# Altium project 80352201 - Main.PrjPcb
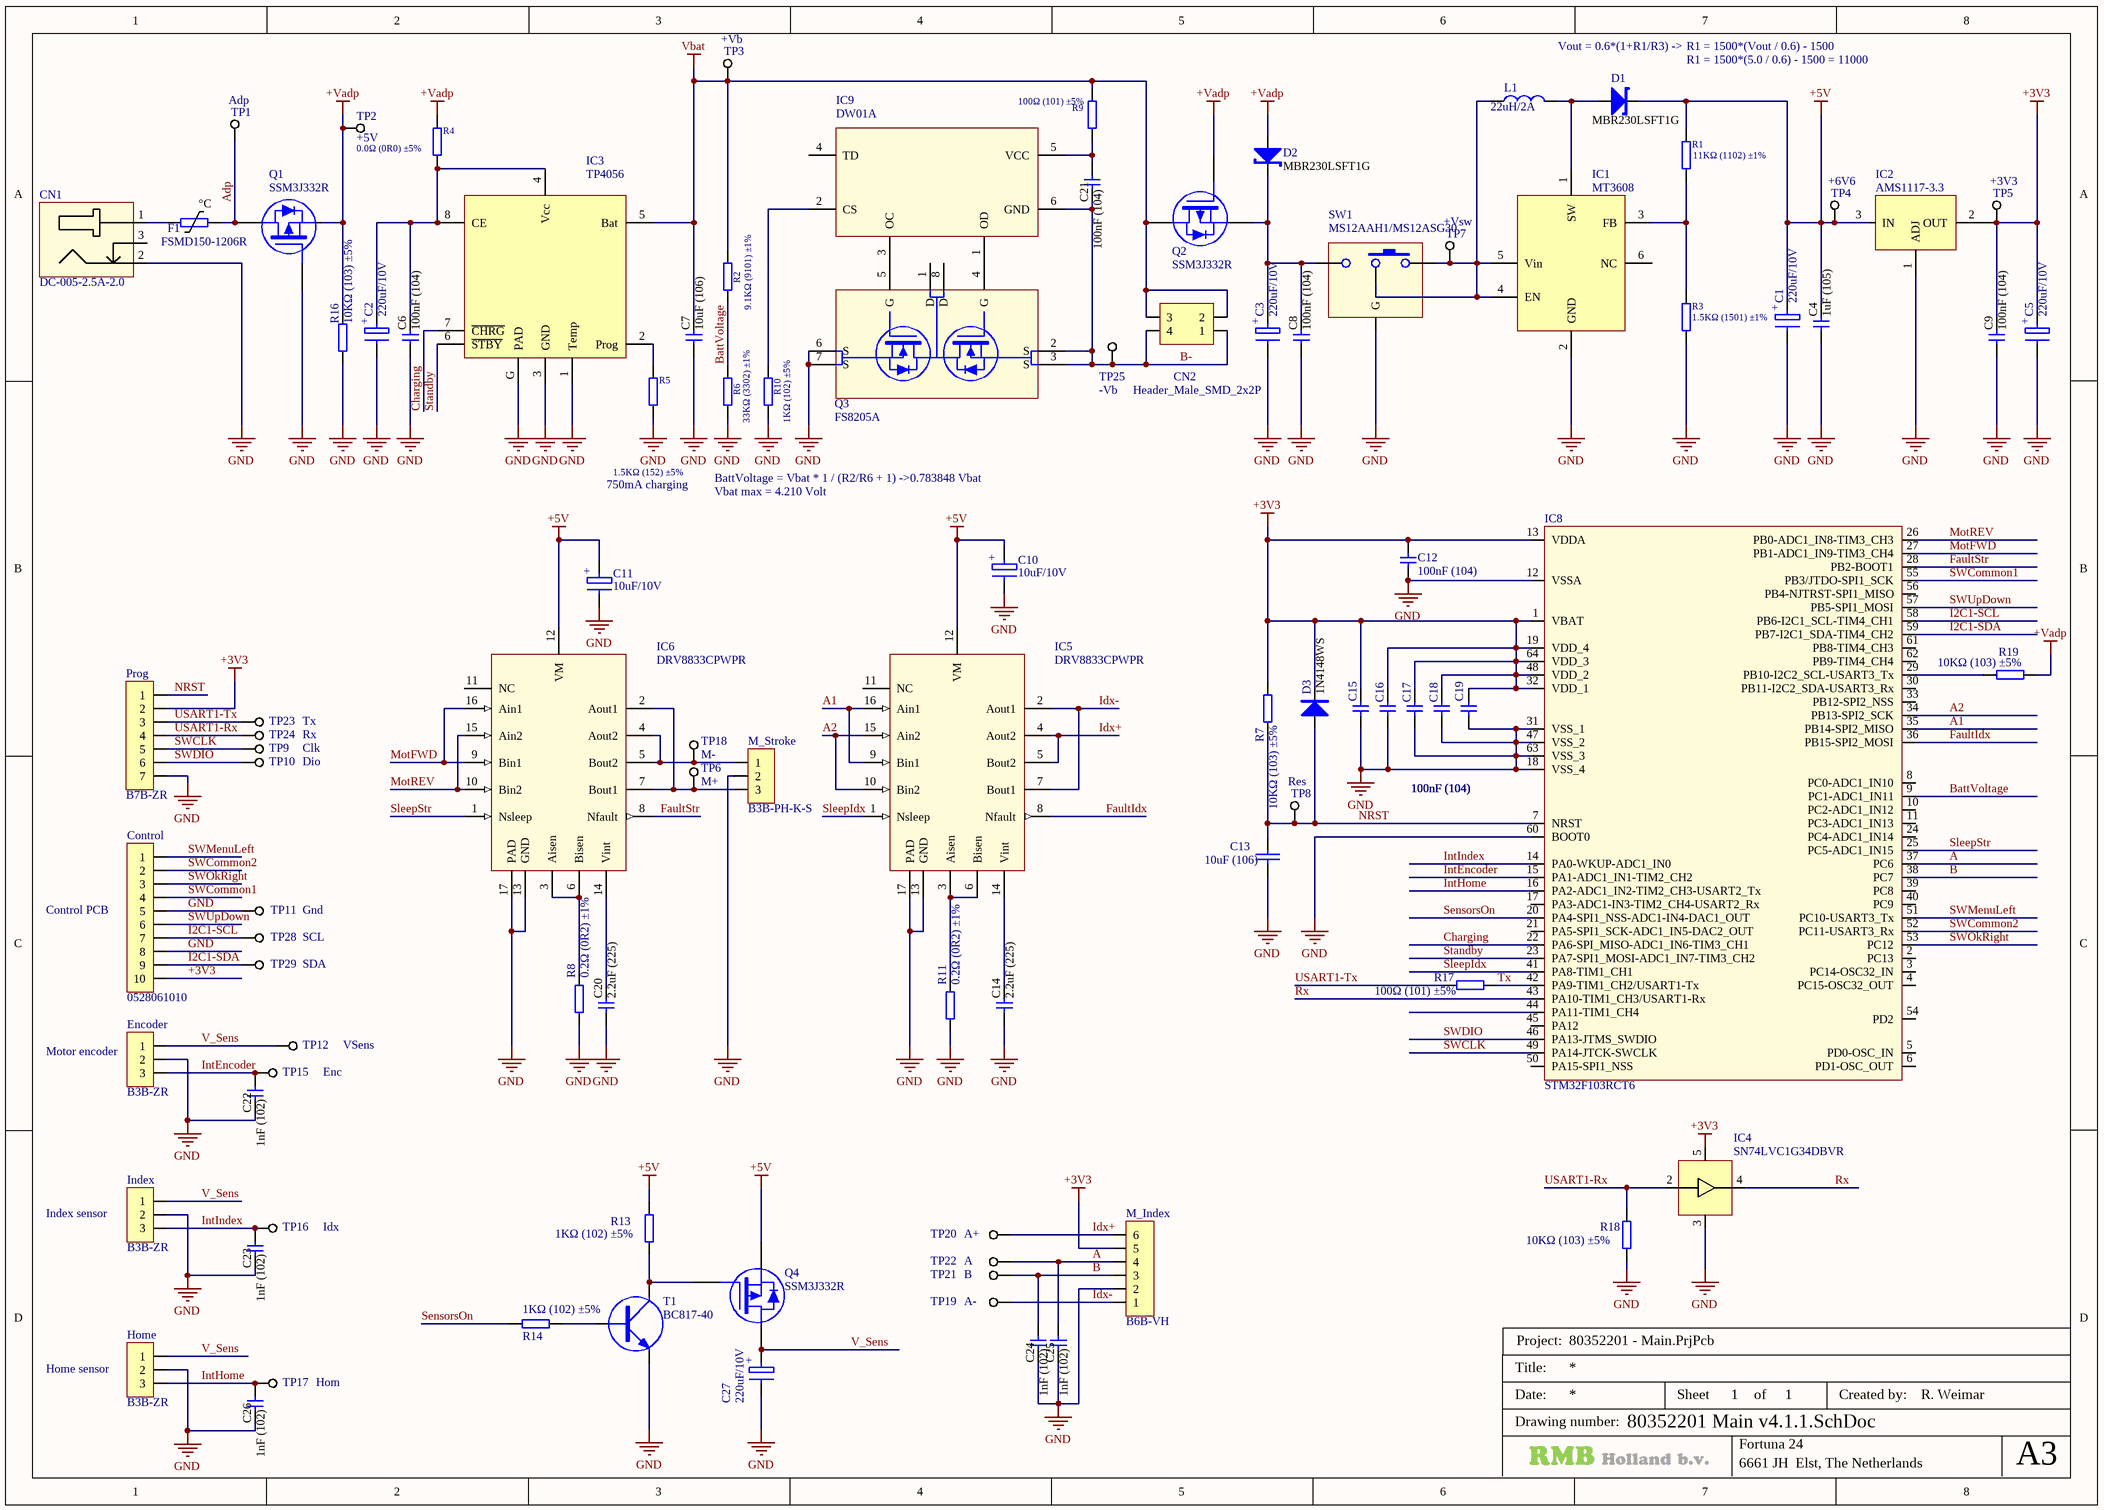
[diagram p0: 80352201 Main v4.1.1.SchDoc]
1 sheet, 97 parts. Net scope: global (net labels, ports and power ports of the same name join across sheets).
Board file: 80362201 Main v4.1.1.PcbDoc

## Sheet 80352201 Main v4.1.1.SchDoc
size A3; SheetNumber: 1; SheetTotal: 1

### Parts
C1  220uF/10V  [C/CAP_POL_6032-28]
C2  220uF/10V  [C/CAP_POL_6032-28]
C3  220uF/10V  [C/CAP_POL_6032-28]
C4  1uF (105)  [C/0603/H]
C5  220uF/10V  [C/CAP_POL_6032-28]
C6  100nF (104)  [C/0603/H]
C7  10uF (106)  [C/0603/H]
C8  100nF (104)  [C/0603/H]
C9  100nF (104)  [C/0603/H]
C10  10uF/10V  [C/CAP_POL_3216-18]
C11  10uF/10V  [C/CAP_POL_3216-18]
C12  100nF (104)  [C/0603/H]
C13  10uF (106)  [C/0603/H]
C14  2.2uF (225)  [C/0603/H]
C15  100nF (104)  [C/0603/H]
C16  100nF (104)  [C/0603/H]
C17  100nF (104)  [C/0603/H]
C18  100nF (104)  [C/0603/H]
C19  100nF (104)  [C/0603/H]
C20  2.2uF (225)  [C/0603/H]
C21  100nF (104)  [C/0603/H]
C22  1nF (102)  [C/0603/H]
C23  1nF (102)  [C/0603/H]
C24  1nF (102)  [C/0603/H]
C25  1nF (102)  [C/0603/H]
C26  1nF (102)  [C/0603/H]
C27  220uF/10V  [C/CAP_POL_6032-28]
CN1  DC-005-2.5A-2.0  [DC-005-2.5A-2.5]
CN2  Header_Male_SMD_2x2P  [Header2x2P_L10]
Control  0528061010  [FPC_1.0-10P_Straight]
D1  MBR230LSFT1G  [SOD123LF]
D2  MBR230LSFT1G  [SOD123LF]
D3  1N4148WS  [SOD123]
Encoder  B3B-ZR  [B3B-ZR]
F1  FSMD150-1206R  [F/1206R_PTC]
Home  B3B-ZR  [B3B-ZR]
IC1  MT3608  [IC/SOT23-6L]
IC2  AMS1117-3.3  [SOT223/Rest]
IC3  TP4056  [HSOP-8]
IC4  SN74LVC1G34DBVR  [SOT753]
IC5  DRV8833CPWPR  [HTSSOP16]
IC6  DRV8833CPWPR  [HTSSOP16]
IC8  STM32F103RCT6  [LQFP64]
IC9  DW01A  [IC/SOT23-6L]
Index  B3B-ZR  [B3B-ZR]
L1  22uH/2A  [Coil12x12]
M_Index  B6B-VH  [B6B-ZR]
M_Stroke  B3B-PH-K-S  [B3B-PH-KL]
Prog  B7B-ZR  [B7B-ZR]
Q1  SSM3J332R  [SOT23-F]
Q2  SSM3J332R  [SOT23-F]
Q3  FS8205A  [TSSOP-8]
Q4  SSM3J332R  [SOT23-F]
R1  11KΩ (1102) ±1%  [r/0603/H]
R2  9.1KΩ (9101) ±1%  [r/0603/H]
R3  1.5KΩ (1501) ±1%  [r/0603/H]
R4  0.0Ω (0R0) ±5%  [R/1206/b]
R5  1.5KΩ (152) ±5%  [r/0603/H]
R6  33KΩ (3302) ±1%  [r/0603/H]
R7  10KΩ (103) ±5%  [r/0603/H]
R8  0.2Ω (0R2) ±1%  [R/2512]
R9  100Ω (101) ±5%  [r/0603/H]
R10  1KΩ (102) ±5%  [r/0603/H]
R11  0.2Ω (0R2) ±1%  [R/2512]
R13  1KΩ (102) ±5%  [r/0603/H]
R14  1KΩ (102) ±5%  [r/0603/H]
R16  10KΩ (103) ±5%  [r/0603/H]
R17  100Ω (101) ±5%  [r/0603/H]
R18  10KΩ (103) ±5%  [r/0603/H]
R19  10KΩ (103) ±5%  [r/0603/H]
SW1  MS12AAH1/MS12ASG30  [NKK_MS12AAH1]
T1  BC817-40  [T/NPN/TO23]
TP1  Adp  [TestPoint1.2]
TP2  +5V  [TestPoint1.2]
TP3  +Vb  [TestPoint1.2]
TP4  +6V6  [TestPoint1.2]
TP5  +3V3  [TestPoint1.2]
TP6  M+  [TestPoint1.2]
TP7  +Vsw  [TestPoint1.2]
TP8  Res  [TestPoint1.2]
TP9  Clk  [TestPoint1.2]
TP10  Dio  [TestPoint1.2]
TP11  Gnd  [TestPoint1.2]
TP12  VSens  [TestPoint1.2]
TP15  Enc  [TestPoint1.2]
TP16  Idx  [TestPoint1.2]
TP17  Hom  [TestPoint1.2]
TP18  M-  [TestPoint1.2]
TP19  A-  [TestPoint1.2]
TP20  A+  [TestPoint1.2]
TP21  B  [TestPoint1.2]
TP22  A  [TestPoint1.2]
TP23  Tx  [TestPoint1.2]
TP24  Rx  [TestPoint1.2]
TP25  -Vb  [TestPoint1.2]
TP28  SCL  [TestPoint1.2]
TP29  SDA  [TestPoint1.2]

### Nets
+3V3: C5.2 C9.1 C12.1 C15.1 C16.2 C17.2 C18.2 C19.1 Control.10 D3.K IC2.2(OUT) IC4.5(VCC) IC8.1(VBAT) IC8.13(VDDA) IC8.19(VDD_4) IC8.32(VDD_1) IC8.48(VDD_2) IC8.64(VDD_3) M_Index.5 Prog.2 R7.2 TP5.1
+5V: C1.2 C4.1 C10.2 C11.2 D1.K IC2.3(IN) IC5.12(VM) IC6.12(VM) Q4.S R1.2 R13.2 TP4.1
+Vadp: D2.A Q1.S Q2.G R4.2 R16.2 R19.1 TP2.1
GND: C1.1 C2.1 C3.1 C4.2 C5.1 C6.2 C7.2 C8.2 C9.2 C10.1 C11.1 C12.2 C13.2 C14.2 C15.2 C16.1 C17.1 C18.1 C19.2 C20.2 C22.2 C23.2 C24.2 C25.2 C26.2 C27.1 CN1.2 Control.5 Control.8 Encoder.2 Home.2 IC1.2(GND) IC2.1(ADJ) IC3.1(Temp) IC3.3(GND) IC3.G(PAD) IC4.3(GND) IC5.13(GND) IC5.17(PAD) IC6.13(GND) IC6.17(PAD) IC8.12(VSSA) IC8.18(VSS_4) IC8.31(VSS_1) IC8.47(VSS_2) IC8.60(BOOT0) IC8.63(VSS_3) Index.2 M_Index.2 M_Stroke.2 Prog.7 Q1.G Q3.6(S) Q3.7(S) R3.1 R5.1 R6.1 R8.1 R10.1 R11.1 R16.1 R18.2 SW1.G T1.E TP11.1
Vbat: C7.1 CN2.2 CN2.3 IC3.5(Bat) Q2.D R2.2 R9.1 TP3.1
A: C25.1 IC8.37(PC6) M_Index.4 TP22.1
A1: IC5.9(Bin1) IC5.16(Ain1) IC8.35(PB14-SPI2_MISO)
A2: IC5.10(Bin2) IC5.15(Ain2) IC8.34(PB13-SPI2_SCK)
Adp: F1.2 Q1.D TP1.1
B: C24.1 IC8.38(PC7) M_Index.3 TP21.1
B-: C21.2 CN2.1 CN2.4 IC9.6(GND) Q3.2(S) Q3.3(S) TP25.1
BattVoltage: IC8.9(PC1-ADC1_IN11) R2.1 R6.2
Charging: IC3.7(~{CHRG}) IC8.22(PA6-SPI_MISO-ADC1_IN6-TIM3_CH1)
FaultIdx: IC5.8(Nfault) IC8.36(PB15-SPI2_MOSI)
FaultStr: IC6.8(Nfault) IC8.28(PB2-BOOT1)
I2C1-SCL: Control.7 IC8.58(PB6-I2C1_SCL-TIM4_CH1) TP28.1
I2C1-SDA: Control.9 IC8.59(PB7-I2C1_SDA-TIM4_CH2) TP29.1
Idx+: IC5.4(Aout2) IC5.5(Bout2) M_Index.6 TP20.1
Idx-: IC5.2(Aout1) IC5.7(Bout1) M_Index.1 TP19.1
IntEncoder: C22.1 Encoder.3 IC8.15(PA1-ADC1_IN1-TIM2_CH2) TP15.1
IntHome: C26.1 Home.3 IC8.16(PA2-ADC1_IN2-TIM2_CH3-USART2_Tx) TP17.1
IntIndex: C23.1 IC8.14(PA0-WKUP-ADC1_IN0) Index.3 TP16.1
MotFWD: IC6.9(Bin1) IC6.16(Ain1) IC8.27(PB1-ADC1_IN9-TIM3_CH4)
MotREV: IC6.10(Bin2) IC6.15(Ain2) IC8.26(PB0-ADC1_IN8-TIM3_CH3)
NRST: C13.1 D3.A IC8.7(NRST) Prog.1 R7.1 TP8.1
Rx: IC4.4(Y) IC8.43(PA10-TIM1_CH3/USART1-Rx)
SensorsOn: IC8.20(PA4-SPI1_NSS-ADC1-IN4-DAC1_OUT) R14.1
SleepIdx: IC5.1(Nsleep) IC8.41(PA8-TIM1_CH1)
SleepStr: IC6.1(Nsleep) IC8.25(PC5-ADC1_IN15)
Standby: IC3.6(~{STBY}) IC8.23(PA7-SPI1_MOSI-ADC1_IN7-TIM3_CH2)
SWCLK: IC8.49(PA14-JTCK-SWCLK) Prog.5 TP9.1
SWCommon1: Control.4 IC8.55(PB3/JTDO-SPI1_SCK)
SWCommon2: Control.2 IC8.52(PC11-USART3_Rx)
SWDIO: IC8.46(PA13-JTMS_SWDIO) Prog.6 TP10.1
SWMenuLeft: Control.1 IC8.51(PC10-USART3_Tx)
SWOkRight: Control.3 IC8.53(PC12)
SWUpDown: Control.6 IC8.57(PB5-SPI1_MOSI)
Tx: IC8.42(PA9-TIM1_CH2/USART1-Tx) R17.1
USART1-Rx: IC4.2(A) Prog.4 R18.1 TP24.1
USART1-Tx: Prog.3 R17.2 TP23.1
V_Sens: C27.2 Encoder.1 Home.1 Index.1 Q4.D TP12.1
NetC2_2: C2.2 C6.1 IC3.4(Vcc) IC3.8(CE) R4.1
NetC3_2: C3.2 C8.1 D2.K Q2.S SW1.3
NetC14_1: C14.1 IC5.14(Vint)
NetC20_1: C20.1 IC6.14(Vint)
NetC21_1: C21.1 IC9.5(VCC) R9.2
NetCN1_1: CN1.1 F1.1
NetD1_A: D1.A IC1.1(SW) L1.2
NetIC1_3: IC1.3(FB) R1.1 R3.2
NetIC1_4: IC1.4(EN) IC1.5(Vin) L1.1 SW1.1 SW1.2 TP7.1
NetIC3_2: IC3.2(Prog) R5.2
NetIC5_3: IC5.3(Aisen) IC5.6(Bisen) R11.2
NetIC6_2: IC6.2(Aout1) IC6.7(Bout1) M_Stroke.3 TP6.1
NetIC6_3: IC6.3(Aisen) IC6.6(Bisen) R8.2
NetIC6_4: IC6.4(Aout2) IC6.5(Bout2) M_Stroke.1 TP18.1
NetIC8_29: IC8.29(PB10-I2C2_SCL-USART3_Tx) R19.2
NetIC9_1: IC9.1(OD) Q3.4(G)
NetIC9_2: IC9.2(CS) R10.2
NetIC9_3: IC9.3(OC) Q3.5(G)
NetQ4_G: Q4.G R13.1 T1.C
NetR14_2: R14.2 T1.B

Not connected (* = marked no-connect by the designer): CN1 3; IC1 6(NC); IC4 1(NC); IC5 11(NC); IC6 11(NC); IC8 2(PC13) 3(PC14-OSC32_IN) 4(PC15-OSC32_OUT) 5(PD0-OSC_IN) 6(PD1-OSC_OUT) 8(PC0-ADC1_IN10) 10(PC2-ADC1_IN12) 11(PC3-ADC1_IN13) 17(PA3-ADC1-IN3-TIM2_CH4-USART2_Rx) 21(PA5-SPI1_SCK-ADC1_IN5-DAC2_OUT) 24(PC4-ADC1_IN14) 30(PB11-I2C2_SDA-USART3_Rx) 33(PB12-SPI2_NSS) 39(PC8) 40(PC9) 44(PA11-TIM1_CH4) 45(PA12) 50(PA15-SPI1_NSS) 54(PD2) 56(PB4-NJTRST-SPI1_MISO) 61(PB8-TIM4_CH3) 62(PB9-TIM4_CH4); IC9 4(TD); Q3 1(D) 8(D)

### Notes on the sheet
- Vout = 0.6*(1+R1/R3) ->
- R1 = 1500*(Vout / 0.6) - 1500
- R1 = 1500*(5.0 / 0.6) - 1500 = 11000
- 750mA charging
- BattVoltage = Vbat * 1 / (R2/R6 + 1) ->0.783848 Vbat
- Vbat max = 4.210 Volt
- (near Control) Control PCB
- (near Encoder) Motor encoder
- (near Index) Index sensor
- (near Home) Home sensor
- Title:
- Date:
- Project:
- Sheet
- of
- Created by:    R. Weimar
- Drawing number:
- Fortuna 24
- 6661 JH  Elst, The Netherlands
- A3
- (in symbol C/CAP_Pol) +
- (in symbol PTC) °C

### Library data of the parts
C1-C3 C5 C10 C11 C27 = C/CAP_Pol: CapacitorPol; Brand: *; Size: Ø15x33 Pitch 8; Material: *
C4 C6-C9 C13-C15 C17 C18 C20-C26 = CAP: Capacitor
  C4 C6-C9 C14 C20-C26: Brand: *; Size: SMD1206; Material: *
C12 C16 C19 = Capacitor non polarized: Manufacturer: Generic; Case/Format: 0603; Tolerance: 10%; Type: SMD Chip Capacitor; Value: 100p
CN1 = DC_Power_Jack: XKB_DC-005-2.5A-2.0_Power jack; Brand: E-Switch
CN2 = CON2*2: Connector; Brand: Molex; Material: *; Size: *
Control = CON10: Molex_0528061010_FPC 1.0 10P Connector; System: Connector
D1 = DIODE_SHOTTKY: Diode; Brand: OnSemi or similar; Size: DO41 Pitch 10; Material: *
D2 = DIODE_SHOTTKY: ON semiconductor_MBR230LSFT1G_Diode; Brand: OnSemi or similar; Size: DO41 Pitch 10; Material: *
D3 = DIODE: Brand: OnSemi or similar; Size: DO41 Pitch 10; Material: *
Encoder Home Index M_Stroke = CON3: Connector; Brand: JST or similar
F1 = PTC: Fuzetec PTC fuse 2.5 A 16V; Brand: LittelFuse or similar; Size: Pitch 10mm; Material: *
IC1 = IC/MT3608: Aerosemi_MT3608_Boost converter; Brand: TI or similar; Size: SOP8; Material: *
IC2 = IC/ASM1117-SOT223: AMS_AMS1117-3.3_Voltage regulator; Brand: AMS-Semitec or similar; Size: SOT223; Material: *
IC3 = IC/TP4056: Top power_TP4056-42-SOP8-PP_18650 charger; Brand: TI or similar; Size: SOP8; Material: *
IC4 = LogicLevelShifter: Bus buffer; Brand: TI; Dimension: SOT753; Material: *
IC5 IC6 = IC/DRV8833CPWPR: TI_DRV8833CPWPR_DC/Stepper motor driver; Brand: TI; Size: HSOP8; Material: *
IC8 = IC/STM32F100RBT6: ST_STM32F103RCT6_Microprocessor
IC9 = IC/DW01A: Protection circuit; Brand: ST or similar; Size: SO8; Material: *
L1 = INDUCTOR1: INDUCTOR; Brand: *; Size: SMD1206; Material: *
M_Index = CON6: Connector; Brand: JST or similar
Prog = CON7: Connector; Brand: JST or similar
Q1 = MOSFET-P-CHANNEL: Toshiba_SSM3J332R_P-Channel MOSFET; Brand: ST or similar; Size: TO220; Material: *
Q2 = MOSFET-P-CHANNEL: N-Channel MOSFET; Brand: ST or similar; Size: TO220; Material: *
Q3 = MOSFET-N-P-DUAL: N-P-Channel MOSFET; Brand: ST or similar; Size: SO8; Material: *
Q4 = MOSFET-P-CHANNEL: P-Channel MOSFET; Brand: AOS; Dimension: SOT23; Material: *
R1-R6 R9 R10 = RES: Resistor; name: 贴片电阻; coding: 11201312000153; Brand: *; Size: SMD1206; Material: *
R7 R8 R11 R16 = RES
R13 R14 R17-R19 = RES: Resistor; Brand: YAGEO/relac/walsin; Dimension: 0603; Material: *
SW1 = SW-SPDT: NKK_MS12AAH1/MS12ASG30_Slide switch; Brand: E-Switch
T1 = T/NPN: Transistor NPN; Brand: DC; Dimension: TO23; Material: *
TP1-TP12 TP15-TP25 TP28 TP29 = TestPoint